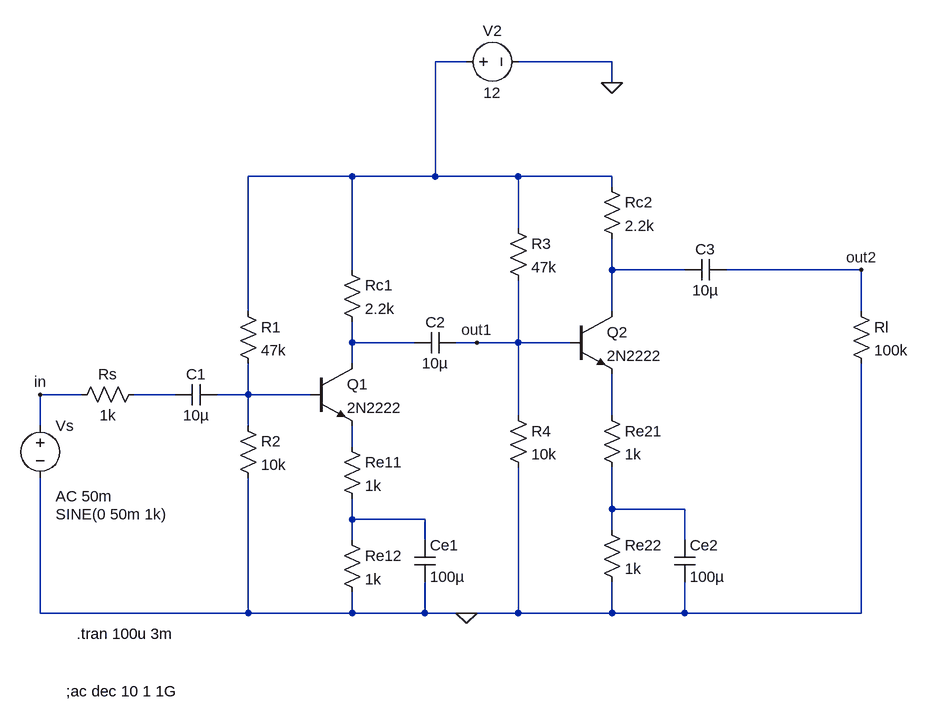
[diagram p0: schematic Two stage RC coupled amplifier.asc]
Two stage RC coupled amplifier.asc, the LTspice schematic file:
Version 4
SHEET 1 880 728
WIRE -1008 -256 -1056 -256
WIRE -784 -256 -928 -256
WIRE -784 -224 -784 -256
WIRE -1184 -80 -1344 -80
WIRE -1056 -80 -1056 -256
WIRE -1056 -80 -1184 -80
WIRE -928 -80 -1056 -80
WIRE -784 -80 -928 -80
WIRE -784 -64 -784 -80
WIRE -928 0 -928 -80
WIRE -1184 64 -1184 -80
WIRE -784 64 -784 16
WIRE -672 64 -784 64
WIRE -400 64 -608 64
WIRE -1344 128 -1344 -80
WIRE -784 128 -784 64
WIRE -400 128 -400 64
WIRE -1184 176 -1184 144
WIRE -1088 176 -1184 176
WIRE -992 176 -1024 176
WIRE -928 176 -928 80
WIRE -928 176 -992 176
WIRE -848 176 -928 176
WIRE -1184 208 -1184 176
WIRE -1600 256 -1664 256
WIRE -1456 256 -1520 256
WIRE -1344 256 -1344 208
WIRE -1344 256 -1392 256
WIRE -1248 256 -1344 256
WIRE -928 288 -928 176
WIRE -784 288 -784 224
WIRE -1664 304 -1664 256
WIRE -1344 304 -1344 256
WIRE -1184 336 -1184 304
WIRE -784 432 -784 368
WIRE -672 432 -784 432
WIRE -1184 448 -1184 416
WIRE -1072 448 -1184 448
WIRE -784 464 -784 432
WIRE -1184 480 -1184 448
WIRE -1072 480 -1072 448
WIRE -672 480 -672 432
WIRE -1664 592 -1664 384
WIRE -1344 592 -1344 384
WIRE -1344 592 -1664 592
WIRE -1184 592 -1184 560
WIRE -1184 592 -1344 592
WIRE -1072 592 -1072 544
WIRE -1072 592 -1184 592
WIRE -1008 592 -1072 592
WIRE -928 592 -928 368
WIRE -928 592 -1008 592
WIRE -784 592 -784 544
WIRE -784 592 -928 592
WIRE -672 592 -672 544
WIRE -672 592 -784 592
WIRE -400 592 -400 208
WIRE -400 592 -672 592
FLAG -784 -224 0
FLAG -1008 592 0
FLAG -1664 256 in
FLAG -400 64 out2
FLAG -992 176 out1
SYMBOL voltage -1664 288 R0
WINDOW 3 24 152 Left 2
WINDOW 123 24 124 Left 2
WINDOW 39 0 0 Left 0
SYMATTR InstName Vs
SYMATTR Value SINE(0 50m 1k)
SYMATTR Value2 AC 50m
SYMBOL res -1504 240 R90
WINDOW 0 0 56 VBottom 2
WINDOW 3 32 56 VTop 2
SYMATTR InstName Rs
SYMATTR Value 1k
SYMBOL cap -1392 240 R90
WINDOW 0 0 32 VBottom 2
WINDOW 3 32 32 VTop 2
SYMATTR InstName C1
SYMATTR Value 10µ
SYMBOL res -1360 288 R0
SYMATTR InstName R2
SYMATTR Value 10k
SYMBOL res -1360 112 R0
SYMATTR InstName R1
SYMATTR Value 47k
SYMBOL npn -1248 208 R0
SYMATTR InstName Q1
SYMATTR Value 2N2222
SYMBOL res -1200 320 R0
SYMATTR InstName Re11
SYMATTR Value 1k
SYMBOL res -1200 464 R0
SYMATTR InstName Re12
SYMATTR Value 1k
SYMBOL res -1200 48 R0
SYMATTR InstName Rc1
SYMATTR Value 2.2k
SYMBOL cap -1088 480 R0
SYMATTR InstName Ce1
SYMATTR Value 100µ
SYMBOL cap -1024 160 R90
WINDOW 0 0 32 VBottom 2
WINDOW 3 32 32 VTop 2
SYMATTR InstName C2
SYMATTR Value 10µ
SYMBOL npn -848 128 R0
SYMATTR InstName Q2
SYMATTR Value 2N2222
SYMBOL res -944 272 R0
SYMATTR InstName R4
SYMATTR Value 10k
SYMBOL res -944 -16 R0
SYMATTR InstName R3
SYMATTR Value 47k
SYMBOL res -800 -80 R0
SYMATTR InstName Rc2
SYMATTR Value 2.2k
SYMBOL res -800 272 R0
SYMATTR InstName Re21
SYMATTR Value 1k
SYMBOL res -800 448 R0
SYMATTR InstName Re22
SYMATTR Value 1k
SYMBOL cap -688 480 R0
SYMATTR InstName Ce2
SYMATTR Value 100µ
SYMBOL res -416 112 R0
SYMATTR InstName Rl
SYMATTR Value 100k
SYMBOL cap -608 48 R90
WINDOW 0 0 32 VBottom 2
WINDOW 3 32 32 VTop 2
SYMATTR InstName C3
SYMATTR Value 10µ
SYMBOL voltage -1024 -256 R270
WINDOW 0 32 56 VTop 2
WINDOW 3 -32 56 VBottom 2
WINDOW 123 0 0 Left 0
WINDOW 39 0 0 Left 0
SYMATTR InstName V2
SYMATTR Value 12
TEXT -1624 712 Left 2 !;ac dec 10 1 1G
TEXT -1608 624 Left 2 !.tran 100u 3m

The netlist it stands for:
* Two stage RC coupled amplifier.asc
Vs in 0 SINE(0 50m 1k) AC 50m
Rs N004 in 1k
C1 N005 N004 10µ
R2 N005 0 10k
R1 N001 N005 47k
Q1 N003 N005 N007 0 2N2222
Re11 N007 N009 1k
Re12 N009 0 1k
Rc1 N001 N003 2.2k
Ce1 N009 0 100µ
C2 out1 N003 10µ
Q2 N002 out1 N006 0 2N2222
R4 out1 0 10k
R3 N001 out1 47k
Rc2 N001 N002 2.2k
Re21 N006 N008 1k
Re22 N008 0 1k
Ce2 N008 0 100µ
Rl out2 0 100k
C3 out2 N002 10µ
V2 N001 0 12
.model NPN NPN
.model PNP PNP
.lib standard.bjt
;ac dec 10 1 1G
.tran 100u 3m
.backanno
.end